# Altium schematic sheet EMG_Connections.SchDoc
size A
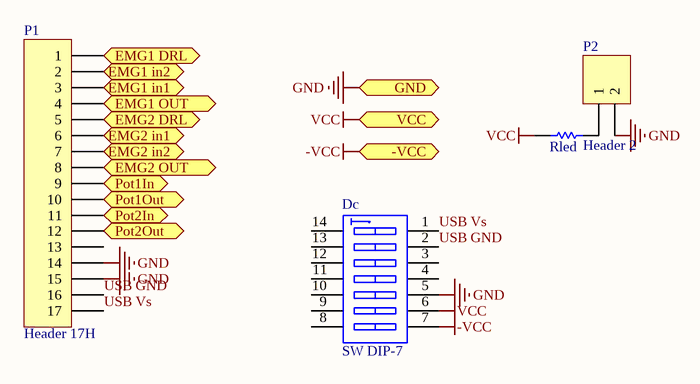
[diagram p0: EMG_Connections.SchDoc]

## Parts
Dc  SW DIP-7  [DIP-14]
P1  Header 17H  [HDR1X17H]
P2  Header 2  [HDR1X2]
Rled  1K 1% 0805(2012)  [RESC0805(2012)_M]  (value not drawn)

## Ports
-VCC, EMG1 DRL, EMG1 in1, EMG1 in2, EMG1 OUT, EMG2 DRL, EMG2 in1, EMG2 in2, EMG2 OUT, GND, Pot1In, Pot1Out, Pot2In, Pot2Out, VCC

## Nets
-VCC: Dc.7(A7) ; port -VCC
GND: Dc.5(A5) P1.14 P1.15 P2.2 ; port GND
VCC: Dc.6(A6) Rled.1 ; port VCC
EMG1 DRL: P1.1 ; port EMG1 DRL
EMG1 in1: P1.3 ; port EMG1 in1
EMG1 in2: P1.2 ; port EMG1 in2
EMG1 OUT: P1.4 ; port EMG1 OUT
EMG2 DRL: P1.5 ; port EMG2 DRL
EMG2 in1: P1.6 ; port EMG2 in1
EMG2 in2: P1.7 ; port EMG2 in2
EMG2 OUT: P1.8 ; port EMG2 OUT
Pot1In: P1.9 ; port Pot1In
Pot1Out: P1.10 ; port Pot1Out
Pot2In: P1.11 ; port Pot2In
Pot2Out: P1.12 ; port Pot2Out
USB GND: Dc.2(A2) P1.16
USB Vs: Dc.1(A1) P1.17
NetP2_1: P2.1 Rled.2

Not connected (* = marked no-connect by the designer): Dc 3(A3) 4(A4) 8(B7) 9(B6) 10(B5) 11(B4) 12(B3) 13(B2) 14(B1); P1 13

## Library data of the parts
Dc = SW DIP-7: DIP Switch, 7 Position, SPST; Published: 24-Mar-1999; LatestRevisionDate: 17-Jul-2002; LatestRevisionNote: Re-released for DXP Platform.; PackageReference: DIP-14; Publisher: Altium Limited; Code_JEDEC: MO-001-AF
P1 = Header 17H: Header, 17-Pin, Right Angle; LatestRevisionDate: 17-Jul-2002; LatestRevisionNote: Re-released for DXP Platform.; Publisher: Altium Limited
P2 = Header 2: Header, 2-Pin; LatestRevisionDate: 17-Jul-2002; LatestRevisionNote: Re-released for DXP Platform.; Publisher: Altium Limited
Rled = CMP-1013-00510-1: 1K 0.125W 1% 0805 (2012 Metric)  SMD; Case-Metric: 2012; Value: 1000.00 Ohm; Case-EIA: 0805; Tolerance: 1 %; Power: 0.125 W; Technology: SMT